# Altium schematic sheet Power.SchDoc: Title (part 3 of 3)
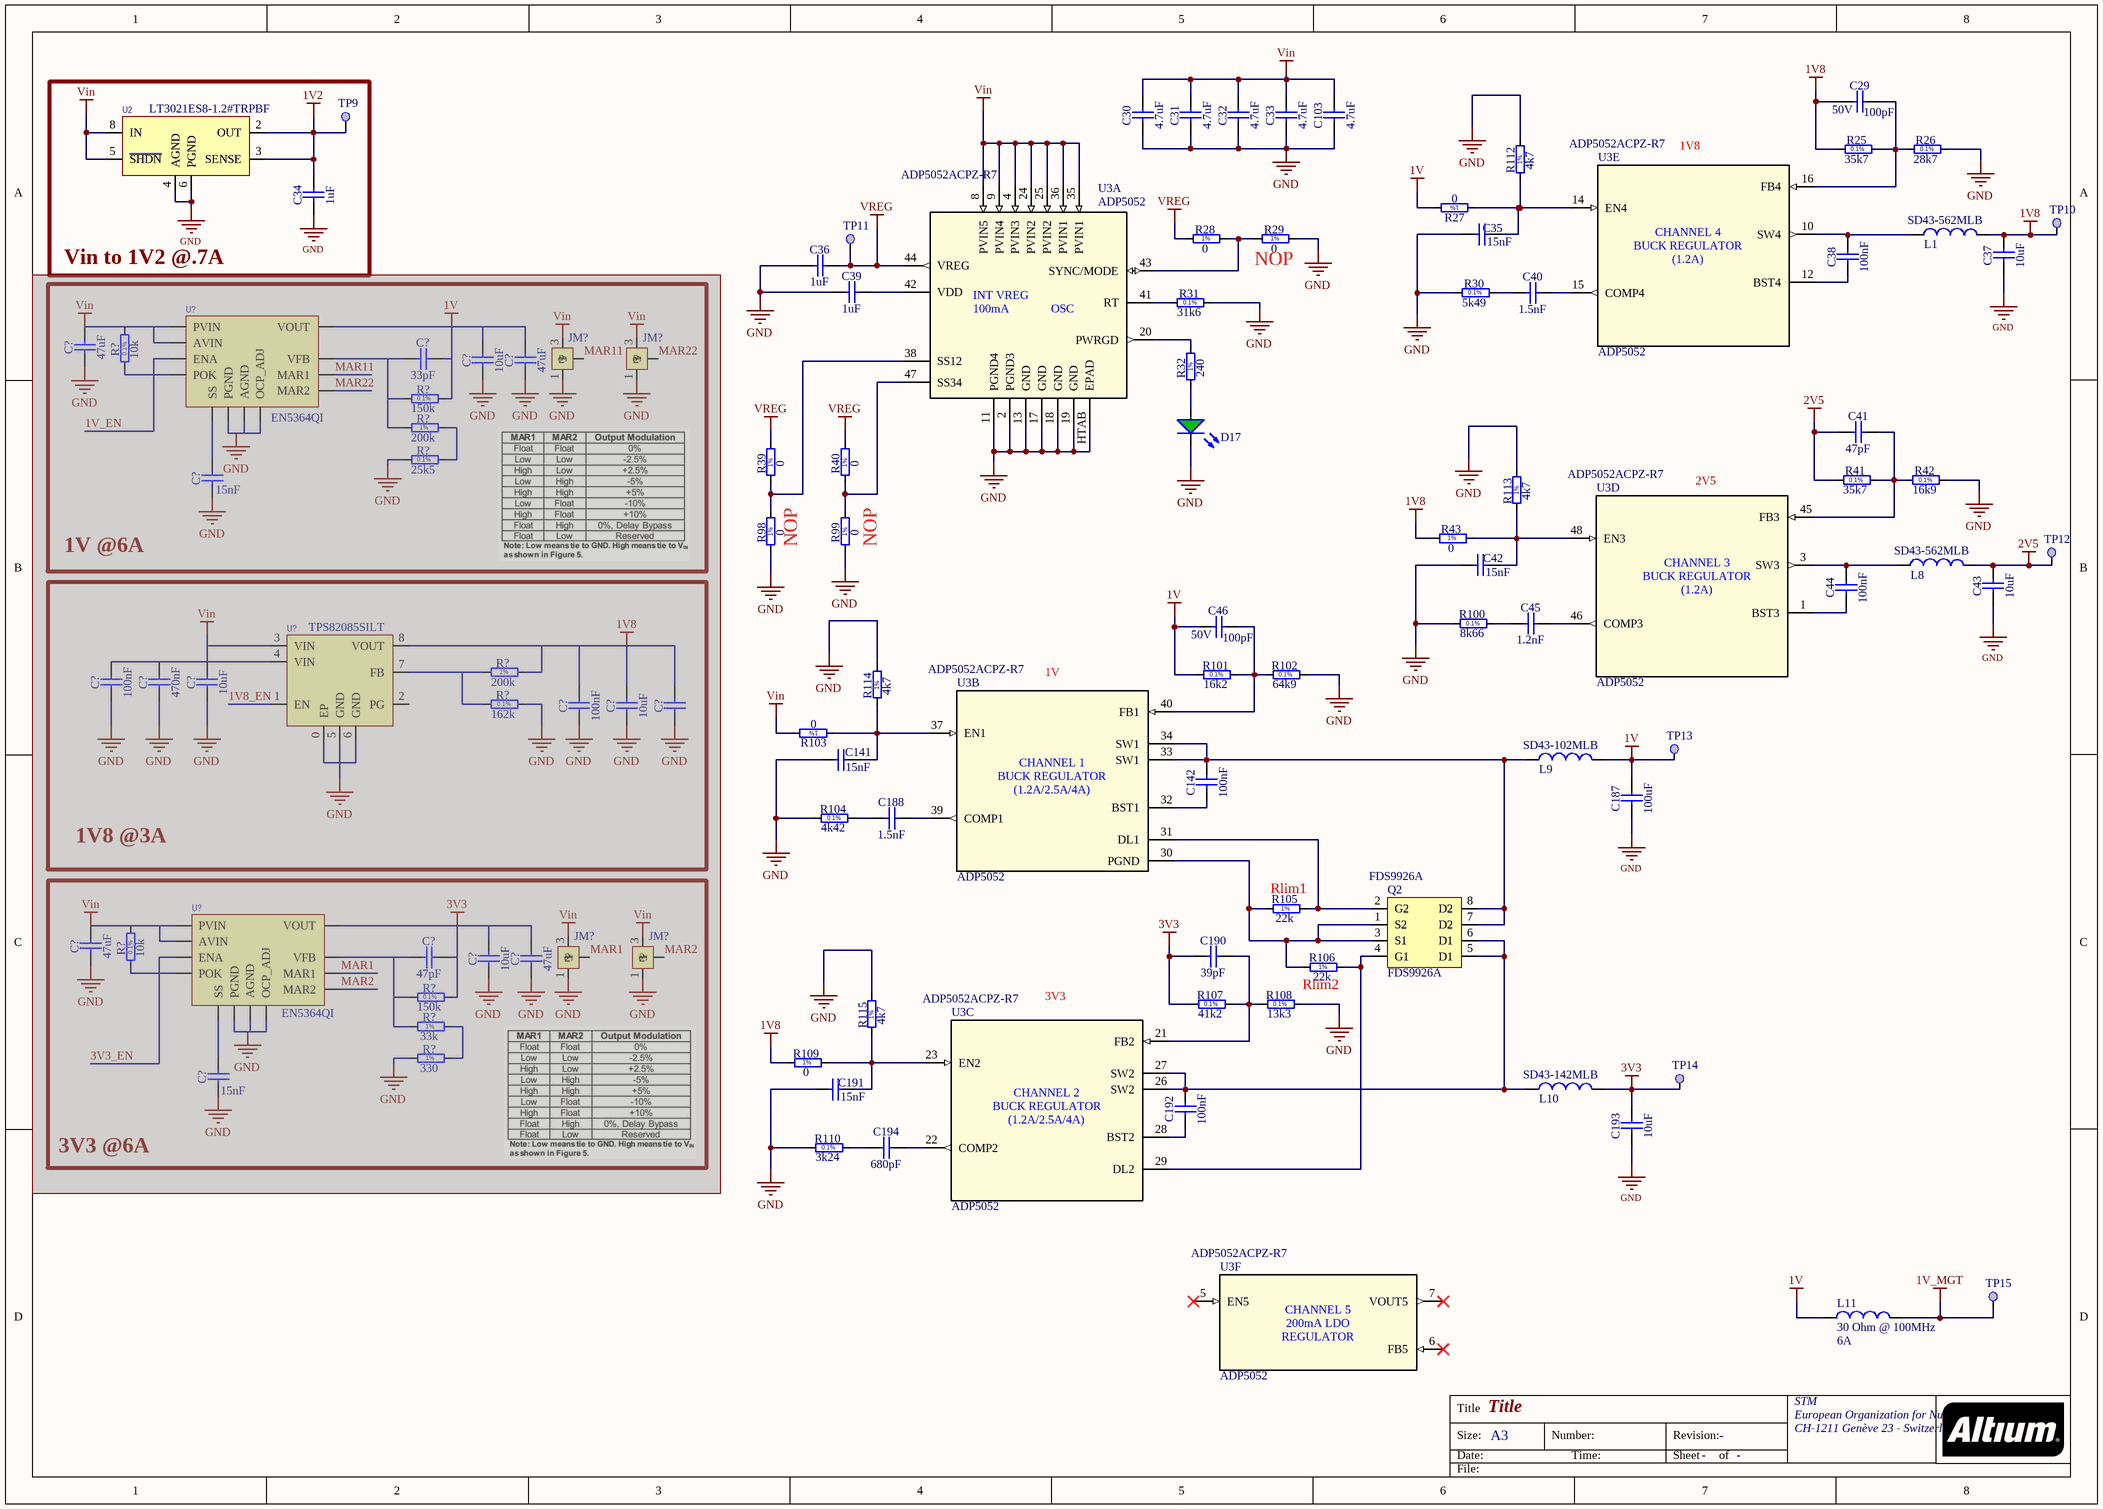
[diagram p2: Power.SchDoc]

## Library data of the parts (continued)
R108 = R0603_13K3_0.1%_0.063W_10PPM: Resistor - 0.1%; Part Description: Thin Film Chip Resistor; Manufacturer: Stackpole Electronics Inc.; Manufacturer Part Number: RMCF0603FT13K3; Manufacturer1 Part Number: RN73C1J13K3BTDF; Power: 0.063W; TC: ±10ppm; Tolerance: ±1%; Table: Resistors SMD; Description: RES SMD 13.3K OHM 1% 1/10W 0603; Power (Watts): 0.1W, 1/10W; Temperature Coefficient: ±100ppm/°C; Resistance (Ohms): 13.3k; Part Number: R0603_13K3_0.1%_0.063W_10PPM; Component Kind: Standard; Component Type: Standard; Pin Count: 2; Value: 13k3; Status: Not recommended; Case: 0603; Mounted: Yes; Socket: No; SMD: Yes; Manufacturer1 Example: TYCO HOLSWORTHY; Manufacturer1 ComponentHeight: 0.5mm; HelpURL: \\cern.ch\dfs\Applications\Altium\Datasheets\R0603_Tyco_RN73.pdf; Author: CERN DEM JLC; CreateDate: 03.12.2007; LatestRevisionDate: 13.03.2008; Height: 0.022" (0.55mm); Number of Terminations: 2; Supplier Device Package: 0603; Package / Case: 0603 (1608 Metric); Category: Resistors; Operating Temperature: -55°C ~ 155°C; Supplier Part Number: RMCF0603FT13K3DKR-ND; Size / Dimension: 0.061" L x 0.031" W (1.55mm x 0.80mm); Features: Automotive AEC-Q200; Packaging: Digi-Reel®; RoHS: RoHS Compliant; Supplier: Digi-Key; Composition: Thick Film
R110 = R0603_3K24_0.1%_0.063W_10PPM: Resistor - 0.1%; Part Description: Thin Film Chip Resistor; Manufacturer: Yageo; Manufacturer Part Number: RC0603FR-073K24L; Manufacturer1 Part Number: RN73C1J3K24BTDF; Power: 0.063W; TC: ±10ppm; Tolerance: ±1%; Table: Resistors SMD; Description: RES SMD 3.24K OHM 1% 1/10W 0603; Resistance (Ohms): 3.24k; Temperature Coefficient: ±100ppm/°C; Power (Watts): 0.1W, 1/10W; Part Number: R0603_3K24_0.1%_0.063W_10PPM; Component Kind: Standard; Component Type: Standard; Pin Count: 2; Value: 3k24; Status: Not recommended; Case: 0603; Mounted: Yes; Socket: No; SMD: Yes; Manufacturer1 Example: TYCO HOLSWORTHY; Manufacturer1 ComponentHeight: 0.5mm; HelpURL: \\cern.ch\dfs\Applications\Altium\Datasheets\R0603_Tyco_RN73.pdf; Author: CERN DEM JLC; CreateDate: 03.12.2007; LatestRevisionDate: 13.03.2008; Composition: Thick Film; Category: Resistors; RoHS: RoHS Compliant; Number of Terminations: 2; Supplier Device Package: 0603; Packaging: Cut Tape (CT); Height: 0.022" (0.55mm); Supplier Part Number: 311-3.24KHRCT-ND; Size / Dimension: 0.063" L x 0.031" W (1.60mm x 0.80mm); Supplier: Digi-Key; Operating Temperature: -55°C ~ 155°C; Features: Moisture Resistant; Package / Case: 0603 (1608 Metric)
R112-R115 = R0603_4K7_1%_0.1W_100PPM: Resistor - 1%; Part Description: General Purpose Thick Film Chip Resistor; Manufacturer: Yageo; Manufacturer Part Number: RC0603JR-074K7L; Manufacturer1 Part Number: NRC06F4701TRF; Power: 0.1W; TC: ±100ppm/°C; Tolerance: ±5%; Table: Resistors SMD; Description: RES SMD 4.7K OHM 5% 1/10W 0603; Resistance (Ohms): 4.7k; Power (Watts): 0.1W, 1/10W; Part Number: R0603_4K7_1%_0.1W_100PPM; Component Kind: Standard; Component Type: Standard; Pin Count: 2; Value: 4k7; Status: Preferred; Case: 0603; Mounted: Yes; Socket: No; SMD: Yes; Manufacturer1 Example: NIC COMPONENT; Manufacturer1 ComponentHeight: 0.55mm; HelpURL: \\cern.ch\dfs\Applications\Altium\Datasheets\R0603_NIC_NRC.pdf; Author: CERN DEM JLC; CreateDate: 03.12.2007; LatestRevisionDate: 13.03.2008; Size / Dimension: 0.063" L x 0.031" W (1.60mm x 0.80mm); Supplier Device Package: 0603; Supplier: Digi-Key; Features: Moisture Resistant; Package / Case: 0603 (1608 Metric); Category: Resistors; Temperature Coefficient: ±100ppm/°C; Number of Terminations: 2; Packaging: Cut Tape (CT); Height: 0.022" (0.55mm); Composition: Thick Film; RoHS: RoHS Compliant; Operating Temperature: -55°C ~ 155°C; Supplier Part Number: 311-4.7KGRCT-ND
R?#1 = R0603_10k_0.1%_0.063W_10PPM: Resistor - 0.1%; Part Description: Thin Film Chip Resistor; Manufacturer: GENERIC; Manufacturer1 Part Number: RN73C1J10KBTDF; Power: 0.063W; TC: ±10ppm; Table: Resistors SMD; Part Number: R0603_10K_0.1%_0.063W_10PPM; Component Kind: Standard; Component Type: Standard; Pin Count: 2; Value: 10k; Status: Not recommended; Tolerance: ±0.1%; Manufacturer Part Number: R0603_10K_0.1%_0.063W_10PPM; Case: 0603; Mounted: Yes; Socket: No; SMD: Yes; Manufacturer1 Example: TYCO HOLSWORTHY; Manufacturer1 ComponentHeight: 0.5mm; HelpURL: \\cern.ch\dfs\Applications\Altium\Datasheets\R0603_Tyco_RN73.pdf; Author: CERN DEM JLC; CreateDate: 3.12.2007; LatestRevisionDate: 13.03.2008
R?#2 R?#8 = R0603_150K_0.1%_0.063W_10PPM: Resistor - 0.1%; Part Description: Thin Film Chip Resistor; Manufacturer: GENERIC; Manufacturer1 Part Number: RN73C1J150KBTDF; Power: 0.063W; TC: ±10ppm; Table: Resistors SMD; Part Number: R0603_150K_0.1%_0.063W_10PPM; Component Kind: Standard; Component Type: Standard; Pin Count: 2; Value: 150k; Status: Not recommended; Tolerance: ±0.1%; Manufacturer Part Number: R0603_150K_0.1%_0.063W_10PPM; Case: 0603; Mounted: Yes; Socket: No; SMD: Yes; Manufacturer1 Example: TYCO HOLSWORTHY; Manufacturer1 ComponentHeight: 0.5mm; HelpURL: \\cern.ch\dfs\Applications\Altium\Datasheets\R0603_Tyco_RN73.pdf; Author: CERN DEM JLC; CreateDate: 3.12.2007; LatestRevisionDate: 13.03.2008
R?#3 R?#5 = R0603_200K_1%_0.1W_100PPM: Resistor - 1%; Part Description: General Purpose Thick Film Chip Resistor; Manufacturer: GENERIC; Manufacturer1 Part Number: NRC06F2003TRF; Power: 0.1W; TC: ±100ppm/°C; Table: Resistors SMD; Part Number: R0603_200K_1%_0.1W_100PPM; Component Kind: Standard; Component Type: Standard; Pin Count: 2; Value: 200k; Status: Preferred; Tolerance: ±1%; Manufacturer Part Number: R0603_200K_1%_0.1W_100PPM; Case: 0603; Mounted: Yes; Socket: No; SMD: Yes; Manufacturer1 Example: NIC COMPONENT; Manufacturer1 ComponentHeight: 0.55mm; HelpURL: \\cern.ch\dfs\Applications\Altium\Datasheets\R0603_NIC_NRC.pdf; Author: CERN DEM JLC; CreateDate: 3.12.2007; LatestRevisionDate: 13.03.2008
R?#4 = R0603_25K5_0.1%_0.063W_10PPM: Resistor - 0.1%; Part Description: Thin Film Chip Resistor; Manufacturer: GENERIC; Manufacturer1 Part Number: RN73C1J25K5BTDF; Power: 0.063W; TC: ±10ppm; Table: Resistors SMD; Part Number: R0603_25K5_0.1%_0.063W_10PPM; Component Kind: Standard; Component Type: Standard; Pin Count: 2; Value: 25k5; Status: Not recommended; Tolerance: ±0.1%; Manufacturer Part Number: R0603_25K5_0.1%_0.063W_10PPM; Case: 0603; Mounted: Yes; Socket: No; SMD: Yes; Manufacturer1 Example: TYCO HOLSWORTHY; Manufacturer1 ComponentHeight: 0.5mm; HelpURL: \\cern.ch\dfs\Applications\Altium\Datasheets\R0603_Tyco_RN73.pdf; Author: CERN DEM JLC; CreateDate: 3.12.2007; LatestRevisionDate: 13.03.2008
R?#6 = R0805_162K_0.1%_0.125W_25PPM: Resistor - 0.1%; Part Description: Thin Film Chip Resistor; Manufacturer: GENERIC; Manufacturer1 Part Number: ERA6AEB1623V; Power: 0.125W; TC: ±25ppm; Table: Resistors SMD; Part Number: R0805_162K_0.1%_0.125W_25PPM; Component Kind: Standard; Component Type: Standard; Pin Count: 2; Value: 162k; Status: Not recommended; Tolerance: ±0.1%; Manufacturer Part Number: R0805_162K_0.1%_0.125W_25PPM; Case: 0805; Mounted: Yes; Socket: No; SMD: Yes; Manufacturer1 Example: PANASONIC; Manufacturer1 ComponentHeight: 0.6mm; HelpURL: \\cern.ch\dfs\Applications\Altium\Datasheets\R0805_PANASONIC_ERA.pdf; Author: CERN DEM JLC; CreateDate: 20.06.2011; LatestRevisionDate: 20.06.2011
R?#7 = R0603_10K_0.1%_0.063W_10PPM: Resistor - 0.1%; Part Description: Thin Film Chip Resistor; Manufacturer: GENERIC; Manufacturer1 Part Number: RN73C1J10KBTDF; Power: 0.063W; TC: ±10ppm; Table: Resistors SMD; Part Number: R0603_10K_0.1%_0.063W_10PPM; Component Kind: Standard; Component Type: Standard; Pin Count: 2; Value: 10k; Status: Not recommended; Tolerance: ±0.1%; Manufacturer Part Number: R0603_10K_0.1%_0.063W_10PPM; Case: 0603; Mounted: Yes; Socket: No; SMD: Yes; Manufacturer1 Example: TYCO HOLSWORTHY; Manufacturer1 ComponentHeight: 0.5mm; HelpURL: \\cern.ch\dfs\Applications\Altium\Datasheets\R0603_Tyco_RN73.pdf; Author: CERN DEM JLC; CreateDate: 3.12.2007; LatestRevisionDate: 13.03.2008
R?#9 = R0603_33K_1%_0.1W_100PPM: Resistor - 1%; Part Description: General Purpose Thick Film Chip Resistor; Manufacturer: GENERIC; Manufacturer1 Part Number: NRC06F3302TRF; Power: 0.1W; TC: ±100ppm/°C; Table: Resistors SMD; Part Number: R0603_33K_1%_0.1W_100PPM; Component Kind: Standard; Component Type: Standard; Pin Count: 2; Value: 33k; Status: Preferred; Tolerance: ±1%; Manufacturer Part Number: R0603_33K_1%_0.1W_100PPM; Case: 0603; Mounted: Yes; Socket: No; SMD: Yes; Manufacturer1 Example: NIC COMPONENT; Manufacturer1 ComponentHeight: 0.55mm; HelpURL: \\cern.ch\dfs\Applications\Altium\Datasheets\R0603_NIC_NRC.pdf; Author: CERN DEM JLC; CreateDate: 3.12.2007; LatestRevisionDate: 13.03.2008
R?#10 = R0603_330R_1%_0.1W_100PPM: Resistor - 1%; Part Description: General Purpose Thick Film Chip Resistor; Manufacturer: GENERIC; Manufacturer1 Part Number: NRC06F3300TRF; Power: 0.1W; TC: ±100ppm/°C; Table: Resistors SMD; Part Number: R0603_330R_1%_0.1W_100PPM; Component Kind: Standard; Component Type: Standard; Pin Count: 2; Value: 330; Status: Preferred; Tolerance: ±1%; Manufacturer Part Number: R0603_330R_1%_0.1W_100PPM; Case: 0603; Mounted: Yes; Socket: No; SMD: Yes; Manufacturer1 Example: NIC COMPONENT; Manufacturer1 ComponentHeight: 0.55mm; HelpURL: \\cern.ch\dfs\Applications\Altium\Datasheets\R0603_NIC_NRC.pdf; Author: CERN DEM JLC; CreateDate: 3.12.2007; LatestRevisionDate: 13.03.2008
TP9-TP15 = Test Point
U2 = LT3021-1.2: IC REG LDO 1.2V 0.5A 8SOIC; Manufacturer: Linear Technology; Current - Output: 500mA; Voltage - Dropout (Typical): 0.155V @ 500mA; Current - Limit (Min): 550mA; Number of Regulators: 1; Voltage - Input: Up to 10V; Regulator Topology: Positive Fixed; Supplier Device Package: 8-SOIC; Package / Case: 8-SOIC (0.154", 3.90mm Width); Operating Temperature: -40°C ~ 125°C; Mounting Type: Surface Mount; Voltage - Output: 1.2V; Packaging: Tape & Reel (TR); RoHS: RoHS Compliant; Category: Integrated Circuits (ICs); Supplier Part Number: LT3021ES8-1.2#TRPBF-ND; Supplier: Digi-Key
U3 = ADP5052ACPZ-R7: Imported; Manufacturer: Analog Devices Inc.; Vendor: ANALOG; C: Copyright (C) 2015 Accelerated Designs. All rights reserved; w/LED Driver: No; Voltage - Supply: 4.5 V ~ 15 V; Voltage/Current - Output 2: 3.3 V ~ 5 V, PROG; Voltage/Current - Output 3: 1.2 V ~ 1.8 V, 1.2A; Topology: Step-Down (Buck) Synchronous (4), Linear (LDO) (1); Number of Outputs: 5; Function: Any Function; Description: IC REG 5OUT BCK/LINEAR 48LFCSP; Voltage/Current - Output 1: 0.85 V ~ 1.6 V, PROG; Frequency - Switching: 740kHz; Manufacturer_Part_Number: ADP5052; Copyright: Copyright (C) 2015 Accelerated Designs. All rights reserved; RefDes: RefDes; Type: Type; Value: Value; Supplier Device Package: 48-LFCSP-WQ (7x7); Operating Temperature: -40°C ~ 125°C; Mounting Type: Surface Mount; Packaging: Tape & Reel (TR); Supplier Part Number: ADP5052ACPZ-R7TR-ND; Category: Integrated Circuits (ICs); RoHS: RoHS Compliant; Supplier: Digi-Key; Package / Case: 48-WFQFN Exposed Pad, CSP; Manufacturer Part Number: ADP5052ACPZ-R7; w/Sequencer: No; w/Supervisor: No
U?#1 U?#3 = EN5364QI: DC/DC CONVERTER 0.6-6.12V 37W; Manufacturer: Altera; Efficiency: 93%; Current - Output (Max): 6A; Voltage - Input (Min): 2.375V; Number of Outputs: 1; Voltage - Input (Max): 6.6V; Voltage - Output 1: 0.6 ~ 6.12 V; Package / Case: 68-QFN; Type: Non-Isolated PoL Module; Packaging: Tape & Reel (TR); Power (Watts) - Max: -; RoHS: RoHS Compliant; Category: Power Supplies - Board Mount; Voltage - Output 3: -; Size / Dimension: 0.43" L x 0.31" W x 0.07" H (11.0mm x 8.0mm x 1.9mm); Manufacturer Part Number: EN5364QI; Supplier: Digi-Key; Voltage - Output 2: -; Power (Watts) - Manufacture Series: -; Features: Remote On/Off, OCP, OTP, SCP, UVLO; Mounting Type: Surface Mount; Operating Temperature: -40°C ~ 85°C; Voltage - Isolation: -; Supplier Part Number: 544-2855-2-ND
U?#2 = TPS82085SILT: IC REG BUCK ADJ 3A SYNC 8USIP; Manufacturer: Texas Instruments; Output Type: Adjustable; Number of Outputs: 1; Synchronous Rectifier: Yes; Voltage - Output (Min/Fixed): 0.8V; Voltage - Input (Min): 2.5V; Function: Step-Down; Voltage - Output (Max): 6V; Frequency - Switching: 2.4MHz; Output Configuration: Positive; RoHS: RoHS Compliant; Category: Integrated Circuits (ICs); Packaging: Digi-Reel®; Voltage - Input (Max): 6V; Topology: Buck; Supplier: Digi-Key; Manufacturer Part Number: TPS82085SILT; Current - Output: 3A; Mounting Type: Surface Mount; Operating Temperature: -40°C ~ 125°C (TJ); Package / Case: 8-LDFN Exposed Pad; Supplier Device Package: 8-uSIP (3x2.8); Supplier Part Number: 296-42112-6-ND